# Altium schematic sheet analog_front_end.SchDoc
size B
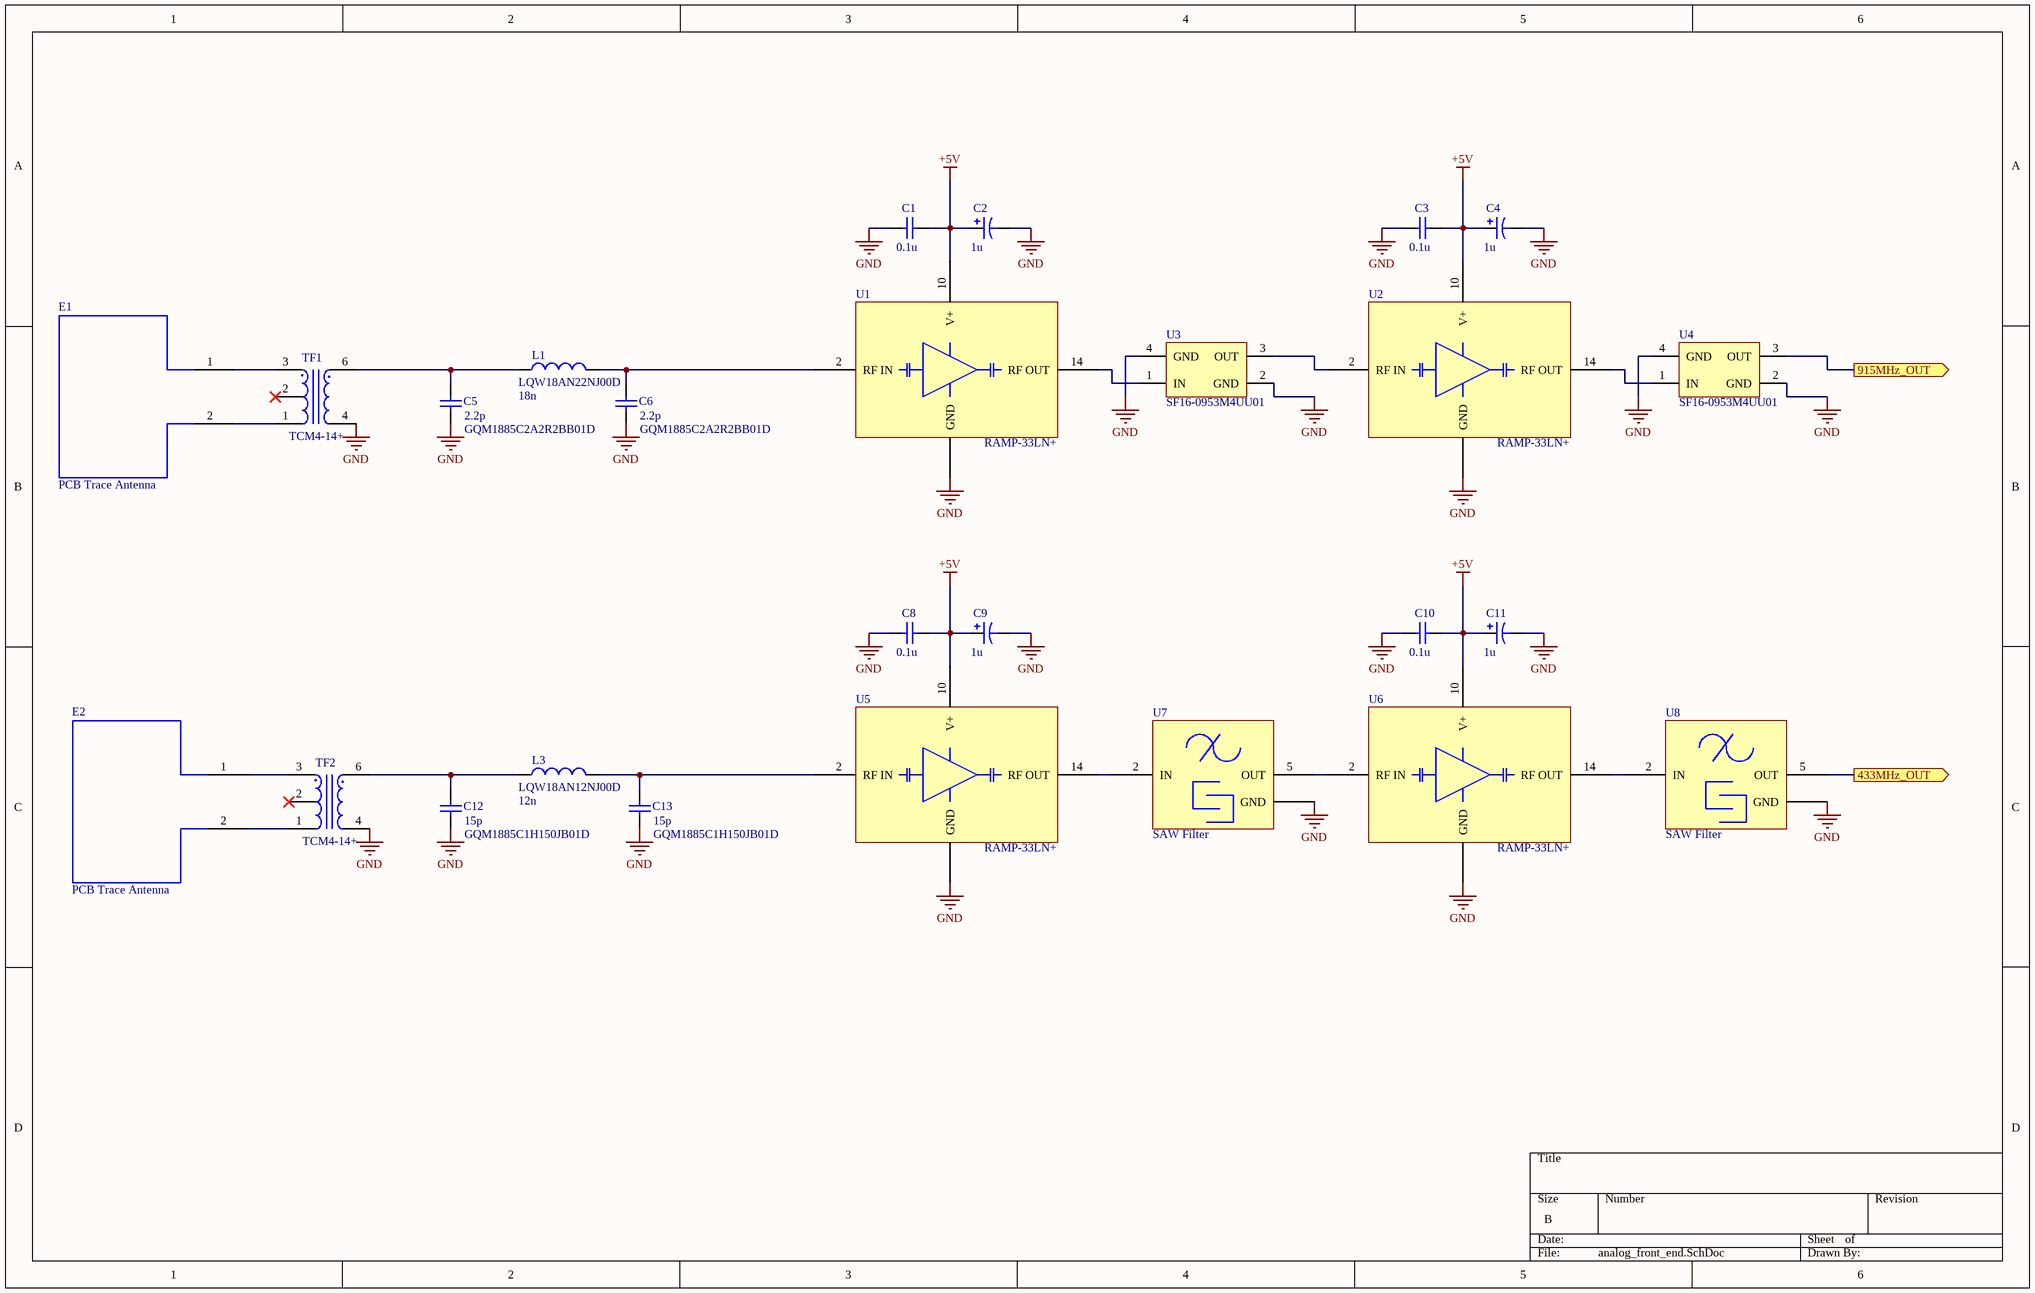
[diagram p0: analog_front_end.SchDoc]

## Parts
C1  value 0.1u  [CAPC1608M]  (hidden comment: Cap Semi)
C2  value 1u  [B]  (hidden comment: Cap Pol3)
C3  value 0.1u  [CAPC1608M]  (hidden comment: Cap Semi)
C4  value 1u  [B]  (hidden comment: Cap Pol3)
C5  GQM1885C2A2R2BB01D  value 2.2p  [CAPC1608M]
C6  GQM1885C2A2R2BB01D  value 2.2p  [CAPC1608M]
C8  value 0.1u  [CAPC1608M]  (hidden comment: Cap Semi)
C9  value 1u  [B]  (hidden comment: Cap Pol3)
C10  value 0.1u  [CAPC1608M]  (hidden comment: Cap Semi)
C11  value 1u  [B]  (hidden comment: Cap Pol3)
C12  GQM1885C1H150JB01D  value 15p  [CAPC1608M]
C13  GQM1885C1H150JB01D  value 15p  [CAPC1608M]
E1  PCB Trace Antenna  [PCB Trace Antenna]
E2  PCB Trace Antenna  [PCB Trace Antenna]
L1  LQW18AN22NJ00D  value 18n  [INDC1608M]
L3  LQW18AN12NJ00D  value 12n  [INDC1608M]
TF1  TCM4-14+  [TCM4-14+]
TF2  TCM4-14+  [TCM4-14+]
U1  RAMP-33LN+  [RAMP-33LN+]
U2  RAMP-33LN+  [RAMP-33LN+]
U3  SF16-0953M4UU01  [SF16-0953M4UU01]
U4  SF16-0953M4UU01  [SF16-0953M4UU01]
U5  RAMP-33LN+  [RAMP-33LN+]
U6  RAMP-33LN+  [RAMP-33LN+]
U7  SAW Filter  [Epcos SAW Filter]
U8  SAW Filter  [Epcos SAW Filter]

## Ports
433MHz_OUT (out), 915MHz_OUT (out)

## Nets
+5V: C1.1 C2.1 C3.1 C4.1 C8.1 C9.1 C10.1 C11.1 U1.10(V+) U2.10(V+) U5.10(V+) U6.10(V+)
GND: C1.2 C2.2 C3.2 C4.2 C5.1 C6.1 C8.2 C9.2 C10.2 C11.2 C12.1 C13.1 TF1.4 TF2.4 U1.1(GND) U1.3(GND) U1.4(GND) U1.5(GND) U1.6(GND) U1.7(GND) U1.8(GND) U1.9(GND) U1.11(GND) U1.12(GND) U1.13(GND) U1.15(GND) U1.16(GND) U2.1(GND) U2.3(GND) U2.4(GND) U2.5(GND) U2.6(GND) U2.7(GND) U2.8(GND) U2.9(GND) U2.11(GND) U2.12(GND) U2.13(GND) U2.15(GND) U2.16(GND) U3.2(GND) U3.4(GND) U4.2(GND) U4.4(GND) U5.1(GND) U5.3(GND) U5.4(GND) U5.5(GND) U5.6(GND) U5.7(GND) U5.8(GND) U5.9(GND) U5.11(GND) U5.12(GND) U5.13(GND) U5.15(GND) U5.16(GND) U6.1(GND) U6.3(GND) U6.4(GND) U6.5(GND) U6.6(GND) U6.7(GND) U6.8(GND) U6.9(GND) U6.11(GND) U6.12(GND) U6.13(GND) U6.15(GND) U6.16(GND) U7.1(GND) U7.3(GND) U7.4(GND) U7.6(GND) U8.1(GND) U8.3(GND) U8.4(GND) U8.6(GND)
433MHz_OUT: U8.5(OUT) ; port 433MHz_OUT
915MHz_OUT: U4.3(OUT) ; port 915MHz_OUT
NetC5_2: C5.2 L1.1 TF1.6
NetC6_2: C6.2 L1.2 U1.2(RF_IN)
NetC12_2: C12.2 L3.1 TF2.6
NetC13_2: C13.2 L3.2 U5.2(RF_IN)
NetE1_1: E1.1 TF1.3
NetE1_2: E1.2 TF1.1
NetE2_1: E2.1 TF2.3
NetE2_2: E2.2 TF2.1
NetU1_14: U1.14(RF_OUT) U3.1(IN)
NetU2_2: U2.2(RF_IN) U3.3(OUT)
NetU2_14: U2.14(RF_OUT) U4.1(IN)
NetU5_14: U5.14(RF_OUT) U7.2(IN)
NetU6_2: U6.2(RF_IN) U7.5(OUT)
NetU6_14: U6.14(RF_OUT) U8.2(IN)

Not connected (* = marked no-connect by the designer): TF1 2*; TF2 2*

## Library data of the parts
C1 C3 C5 C6 C8 C10 C12 C13 = Cap Semi: Capacitor (Semiconductor SIM Model); Published: 8-Jun-2000; LatestRevisionDate: 29-May-2009; LatestRevisionNote: IPC-7351 Footprint Added.; PackageReference: C1206; Publisher: Altium Limited; PackageDescription: Chip Capacitor
C2 C4 C9 C11 = Cap Pol3: Polarized Capacitor (Surface Mount); Published: 8-Jun-2000; LatestRevisionDate: 29-May-2009; LatestRevisionNote: IPC-7351 Footprint Added.; PackageReference: C0805; Publisher: Altium Limited; PackageDescription: Chip Capacitor
L1 L3 = Inductor: Code_IEC: 1005; Published: 8-Jun-2000; LatestRevisionDate: 29-May-2009; LatestRevisionNote: IPC-7351 Footprint Added.; PackageReference: 0402-A; Publisher: Altium Limited; PackageDescription: Chip Inductor; Code_JEITA: 0402
TF1 TF2 = TCM4-14+: Mini-Circuits Surface Mount RF Transformer; Manufacturer's Part No.: TCM4-14+; Mini-Circuits: TCM4-14+
U1 U2 U5 U6 = RAMP-33LN+: Mini-Circuits - RAMP-33LN+; Manufacturer's Part No.: RAMP-33LN+
U3 U4 = SF16-0953M4UU01: AVX Corp/Kyocera Corp - FILTER SAW 953MHZ RF SMD; Digikey Number: 478-6489-1-ND